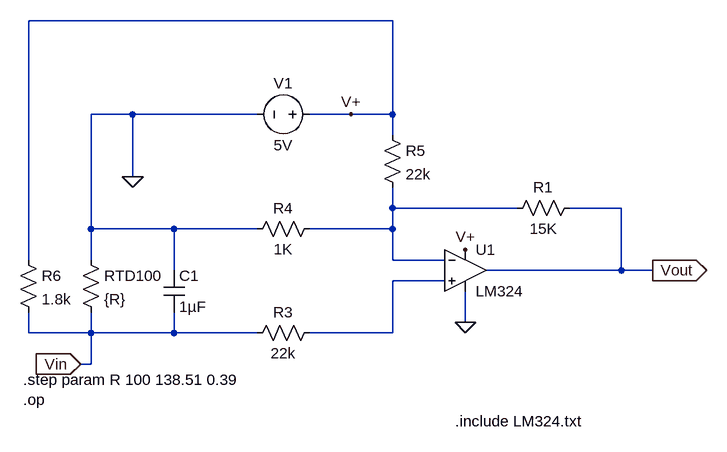
[diagram p0: schematic PT100_Amplifier_Circuit.asc]
PT100_Amplifier_Circuit.asc, the LTspice schematic file:
Version 4
SHEET 1 880 680
WIRE 224 -256 -336 -256
WIRE -176 -112 -240 -112
WIRE 16 -112 -176 -112
WIRE 160 -112 96 -112
WIRE 224 -112 224 -256
WIRE 224 -112 160 -112
WIRE 224 -80 224 -112
WIRE -176 -16 -176 -112
WIRE 224 32 224 0
WIRE 416 32 224 32
WIRE 576 32 496 32
WIRE -240 64 -240 -112
WIRE -112 64 -240 64
WIRE 16 64 -112 64
WIRE 224 64 224 32
WIRE 224 64 96 64
WIRE -336 112 -336 -256
WIRE -240 112 -240 64
WIRE 224 112 224 64
WIRE 304 112 224 112
WIRE -112 128 -112 64
WIRE 576 128 576 32
WIRE 576 128 368 128
WIRE 624 128 576 128
WIRE 304 144 224 144
WIRE 336 208 336 160
WIRE -336 224 -336 192
WIRE -240 224 -240 192
WIRE -240 224 -336 224
WIRE -112 224 -112 192
WIRE -112 224 -240 224
WIRE 16 224 -112 224
WIRE 224 224 224 144
WIRE 224 224 96 224
WIRE -240 272 -240 224
WIRE -240 272 -256 272
FLAG 160 -112 V+
FLAG 336 208 0
FLAG -176 -16 0
FLAG 336 96 V+
FLAG 624 128 Vout
IOPIN 624 128 Out
FLAG -256 272 Vin
IOPIN -256 272 In
SYMBOL Opamps\\opamp2 336 64 R0
SYMATTR InstName U1
SYMATTR Value LM324
SYMBOL res 512 16 R90
WINDOW 0 0 56 VBottom 2
WINDOW 3 32 56 VTop 2
SYMATTR InstName R1
SYMATTR Value 15K
SYMATTR SpiceLine pwr=0.1
SYMBOL res 112 208 R90
WINDOW 0 0 56 VBottom 2
WINDOW 3 32 56 VTop 2
SYMATTR InstName R3
SYMATTR Value 22k
SYMATTR SpiceLine pwr=0.1
SYMBOL res 112 48 R90
WINDOW 0 0 56 VBottom 2
WINDOW 3 32 56 VTop 2
SYMATTR InstName R4
SYMATTR Value 1K
SYMATTR SpiceLine pwr=0.1
SYMBOL res 208 -96 R0
SYMATTR InstName R5
SYMATTR Value 22k
SYMATTR SpiceLine pwr=0.1
SYMBOL res -352 96 R0
SYMATTR InstName R6
SYMATTR Value 1.8k
SYMATTR SpiceLine pwr=0.1
SYMBOL res -256 96 R0
SYMATTR InstName RTD100
SYMATTR Value {R}
SYMBOL voltage 112 -112 R90
WINDOW 0 -32 56 VBottom 2
WINDOW 3 32 56 VTop 2
SYMATTR InstName V1
SYMATTR Value 5V
SYMBOL cap -128 128 R0
SYMATTR InstName C1
SYMATTR Value 1µF
TEXT 320 360 Left 2 !.include LM324.txt
TEXT -344 296 Left 2 !.step param R 100 138.51 0.39\n.op

The netlist it stands for:
* PT100_Amplifier_Circuit.asc
XU1 N002 N001 V+ 0 Vout LM324  ; pins In+ In- V+ V- OUT
R1 Vout N001 15K pwr=0.1
R3 N002 Vin 22k pwr=0.1
R4 N001 0 1K pwr=0.1
R5 V+ N001 22k pwr=0.1
R6 V+ Vin 1.8k pwr=0.1
RTD100 0 Vin {R}
V1 V+ 0 5V
C1 0 Vin 1µF
.include LM324.txt
.step param R 100 138.51 0.39
.op
.backanno
.end

* Results of the author's LTspice run, read from the files saved beside the schematic
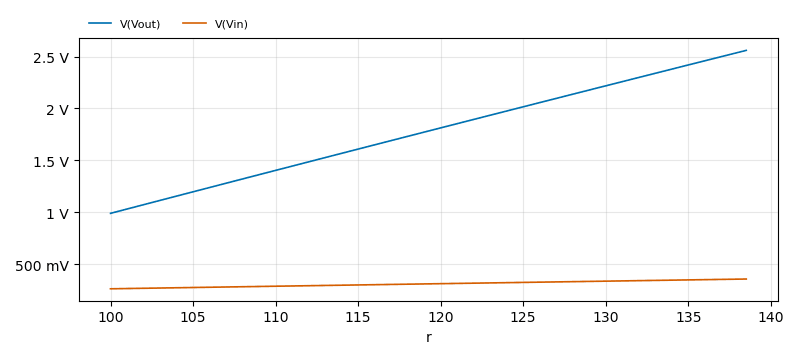
[diagram p1: Operating Point of PT100_Amplifier_Circuit.asc, plotted from the saved traces]
* Operating Point, 1 run:
*   V(Vout): 989.8 mV at r=100 , 2.559 V at r=138.5 , min 989.8 mV, max 2.559 V
*   V(Vin): 263.2 mV at r=100 , 357.3 mV at r=138.5 , min 263.2 mV, max 357.3 mV